# EAGLE schematic rgb-led_alt (EAGLE 7.6.0)
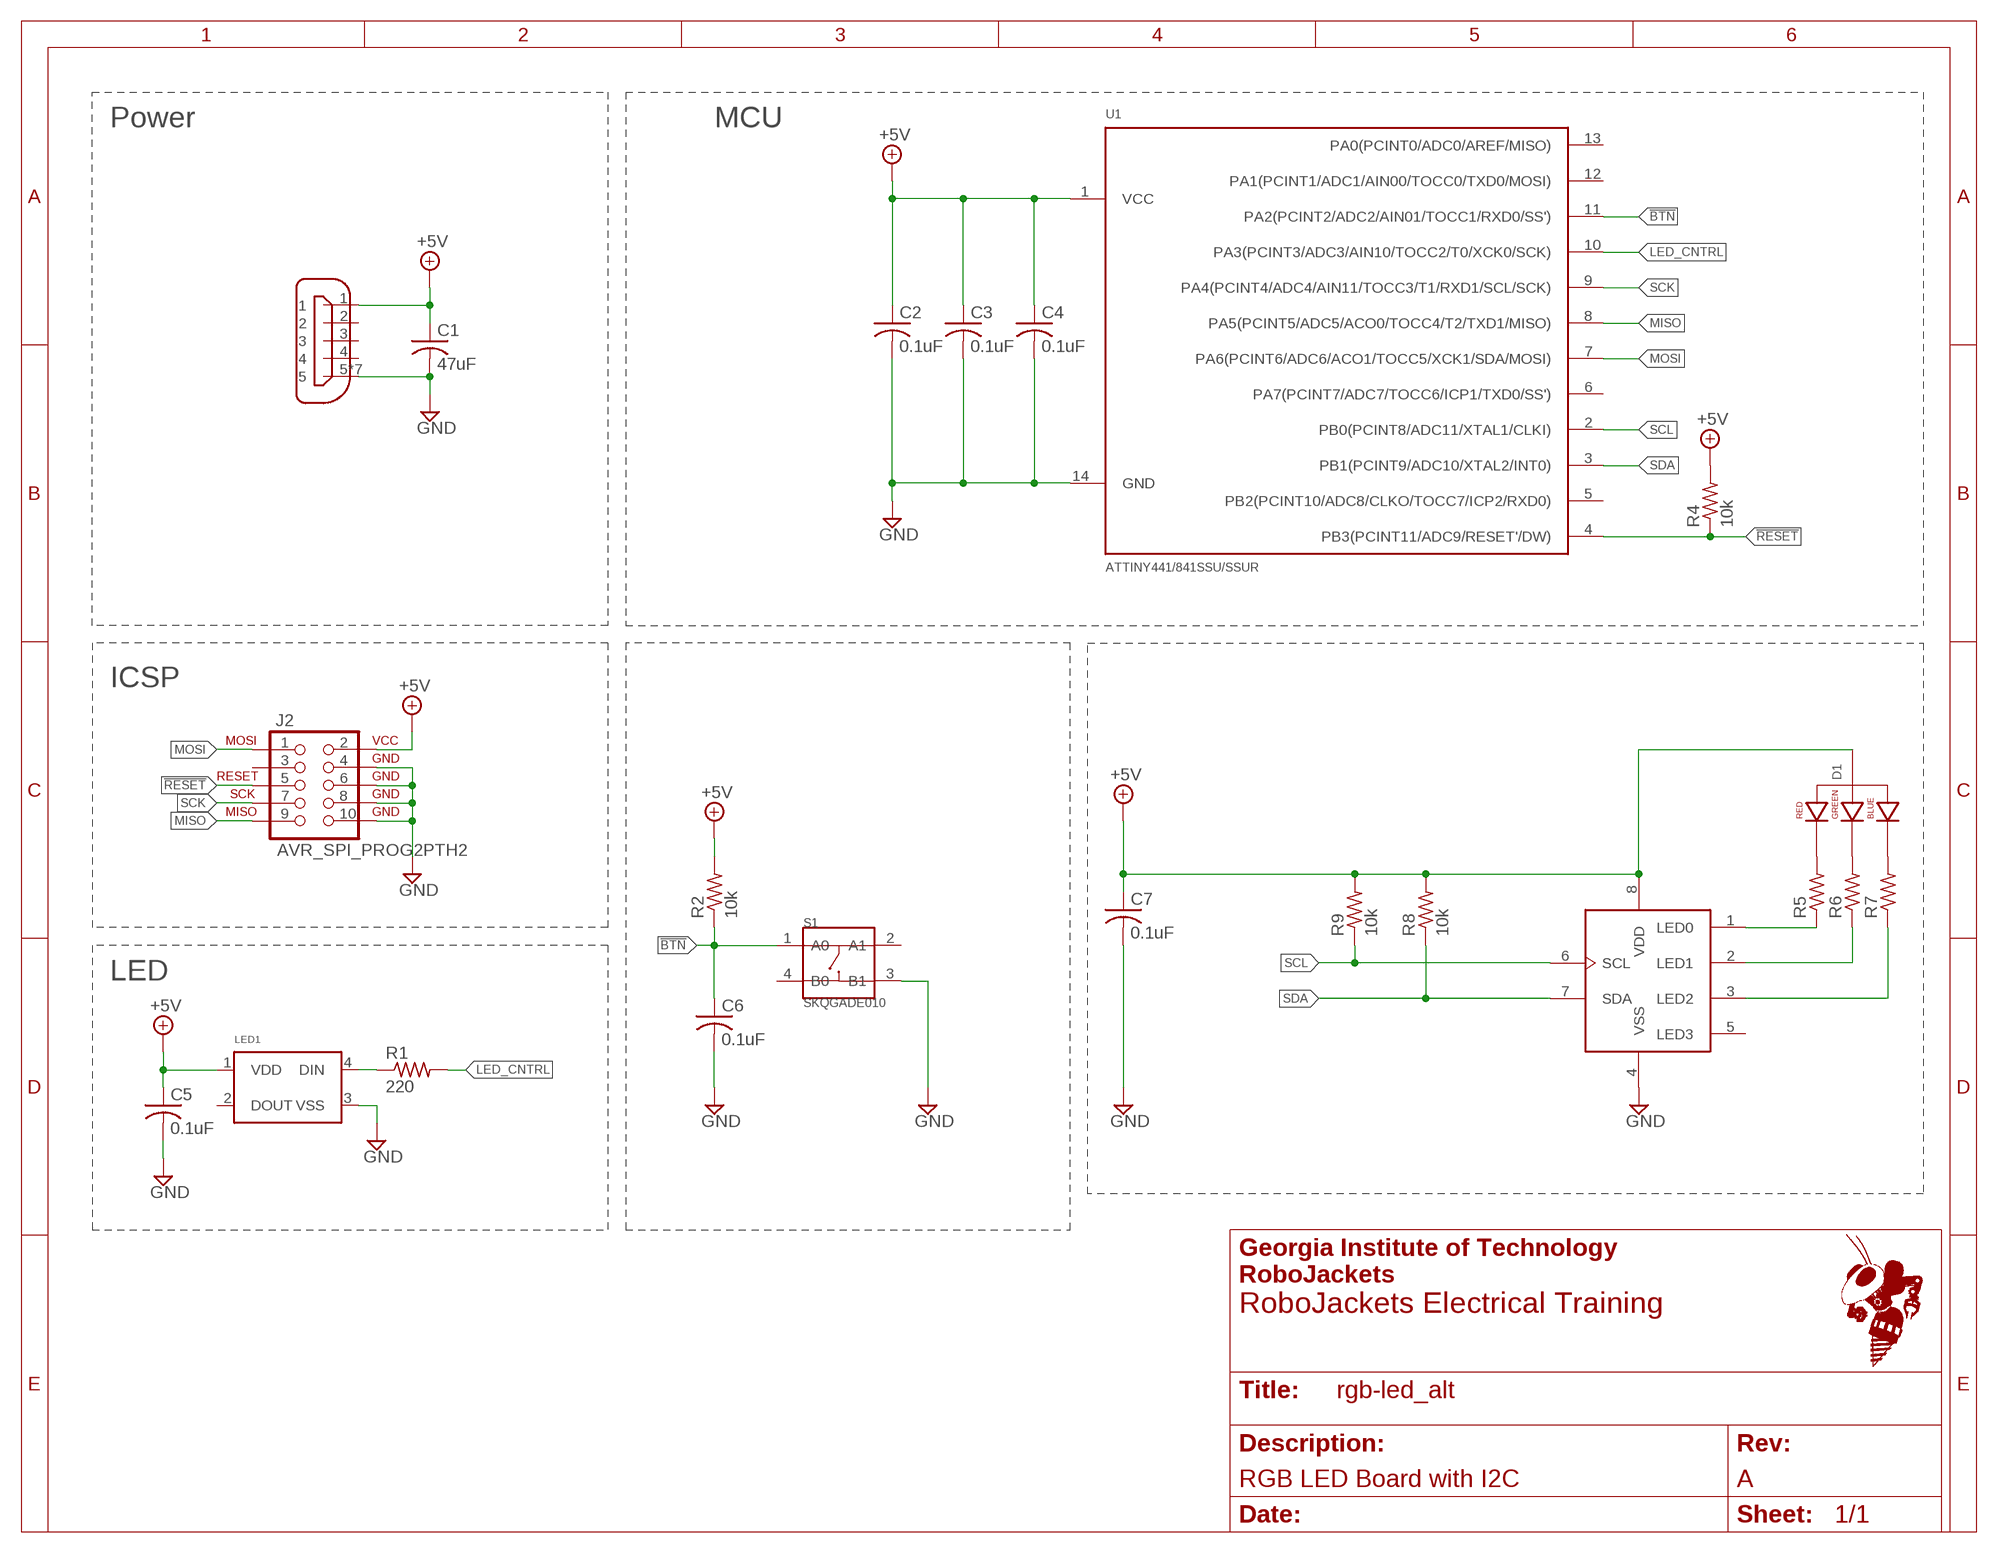
[diagram p0: schematic, sheet 1]
FRAME1 (FRAME_A_L): REVISION: A; SCH_DESC: RGB LED Board with I2C; TEAM: RoboJackets Electrical Training

## Parts
C1  47uF  C-USC1206  [C1206]
C2  0.1uF  C-USC0603  [C0603]
C3  0.1uF  C-USC0603  [C0603]
C4  0.1uF  C-USC0603  [C0603]
C5  0.1uF  C-USC0603  [C0603]
C6  0.1uF  C-USC0603  [C0603]
C7  0.1uF  C-USC0603  [C0603]
D1  LED-RGB-CA-THRUCLEAR  [LED-RGB-THRU]
J1  MICRO-USB  [GS-14-2180]
J2  AVR_SPI_PROG2PTH2  [2X5-SHROUDED]
LED1  WS2812B  [5050]
R1  220  R-US_R0603  [R0603]
R2  10k  R-US_R0603  [R0603]
R4  10k  R-US_R0603  [R0603]
R5  R-US_R0603  [R0603]
R6  R-US_R0603  [R0603]
R7  R-US_R0603  [R0603]
R8  10k  R-US_R0603  [R0603]
R9  10k  R-US_R0603  [R0603]
S1  SKQGADE010  SMD-SWITCH-TOP-260GF(4P-D5.2MM)  [SW4-SMD-5.2X5.2X1.5MM]
U1  ATTINY441/841SSU/SSUR  [SOIC-14]
U2  PCA9533  [SOIC8]

## Nets
!BTN: C6.1 R2.1 S1.1(A0) U1.11(PA2(PCINT2/ADC2/AIN01/TOCC1/RXD0/SS'))
!RESET: J2.5(RESET) R4.1 U1.4(PB3(PCINT11/ADC9/RESET'/DW))
+5V [PWR]: C1.1 C2.1 C3.1 C4.1 C5.1 C7.1 D1.2(ANODE) J1.1 J2.2(VCC) LED1.1(VDD) R2.2 R4.2 R8.2 R9.2 U1.1(VCC) U2.8(VDD)
GND: C1.2 C2.2 C3.2 C4.2 C5.2 C6.2 C7.2 J1.5 J1.5@1 J1.5@2 J1.5@3 J1.5@4 J1.5@6 J1.5@7 J2.4(GND) J2.6(GND) J2.8(GND) J2.10(GND) LED1.3(VSS) S1.3(B1) U1.14(GND) U2.4(VSS)
LED_CNTRL: R1.2 U1.10(PA3(PCINT3/ADC3/AIN10/TOCC2/T0/XCK0/SCK))
MISO: J2.9(MISO) U1.8(PA5(PCINT5/ADC5/ACO0/TOCC4/T2/TXD1/MISO))
MOSI: J2.1(MOSI) U1.7(PA6(PCINT6/ADC6/ACO1/TOCC5/XCK1/SDA/MOSI))
N$1: LED1.4(DIN) R1.1
N$6: D1.1(RED_CATHODE) R5.2
N$9: D1.3(GREEN_CATHODE) R6.2
N$10: D1.4(BLUE_CATHODE) R7.2
N$11: R5.1 U2.1(LED0)
N$12: R6.1 U2.2(LED1)
N$13: R7.1 U2.3(LED2)
SCK: J2.7(SCK) U1.9(PA4(PCINT4/ADC4/AIN11/TOCC3/T1/RXD1/SCL/SCK))
SCL: R9.1 U1.2(PB0(PCINT8/ADC11/XTAL1/CLKI)) U2.6(SCL)
SDA: R8.1 U1.3(PB1(PCINT9/ADC10/XTAL2/INT0)) U2.7(SDA)
Unconnected: J1.2 J1.3 J1.4 J2.3(NC) LED1.2(DOUT) S1.2(A1) S1.4(B0) U1.5(PB2(PCINT10/ADC8/CLKO/TOCC7/ICP2/RXD0)) U1.6(PA7(PCINT7/ADC7/TOCC6/ICP1/TXD0/SS')) U1.12(PA1(PCINT1/ADC1/AIN00/TOCC0/TXD0/MOSI)) U1.13(PA0(PCINT0/ADC0/AREF/MISO)) U2.5(LED3)

## Notes on the sheet
- Power | MCU
- ICSP
- LED

## Library data of the parts
C1-C7 = rcl:C-US: CAPACITOR, American symbol
D1 = rgb-led:LED-RGB-CA-THRU: RGB Through-hole common anode SparkFun store front COM-10821 (diffuse) COM-10820 (clear); PROD_ID: DIO-10631
J1 = rgb-led:MICRO-USB
J2 = rgb-led:AVR_SPI_PROG2: AVR 10-pin ICSP Header This is the standard AVR In Circuit Serial Programming header. Minimal, but includes pin one indicator. Works with standard Olimex programmers. Also look for the 6-pin reduced version. Spark Fun Electronics SKU: PRT-00778
LED1 = rgb-led:WS2812B: WS2812B 5050 RGB LED with Integrated Driver Chip http://www.adafruit.com/products/1655
R1 = rcl:R-US_: RESISTOR, American symbol
R2 R4-R9 = resistor:R-US_: RESISTOR, American symbol
S1 = Seeed-OPL-Button:SMD-SWITCH-TOP-260GF(4P-D5.2MM): 311020017; MPN: SKQGADE010
U1 = rgb-led:ATTINY441/841
U2 = adam - ics:PCA9533: PCA9533D/01: LED driver and dimmer 4 channel, PWM @ 8 bit resolution 25mA / channel sink external resistors per LED I2C protocol @ 400kHz (fast) digikey: 568-3372-5-ND, 8-SOIC, $1.92

## Net classes
0 default: width 0.203 mm
1 PWR: width 0.254 mm